# Altium schematic sheet Overview.SchDoc
size A; SheetNumber: 1; SheetTotal: 4
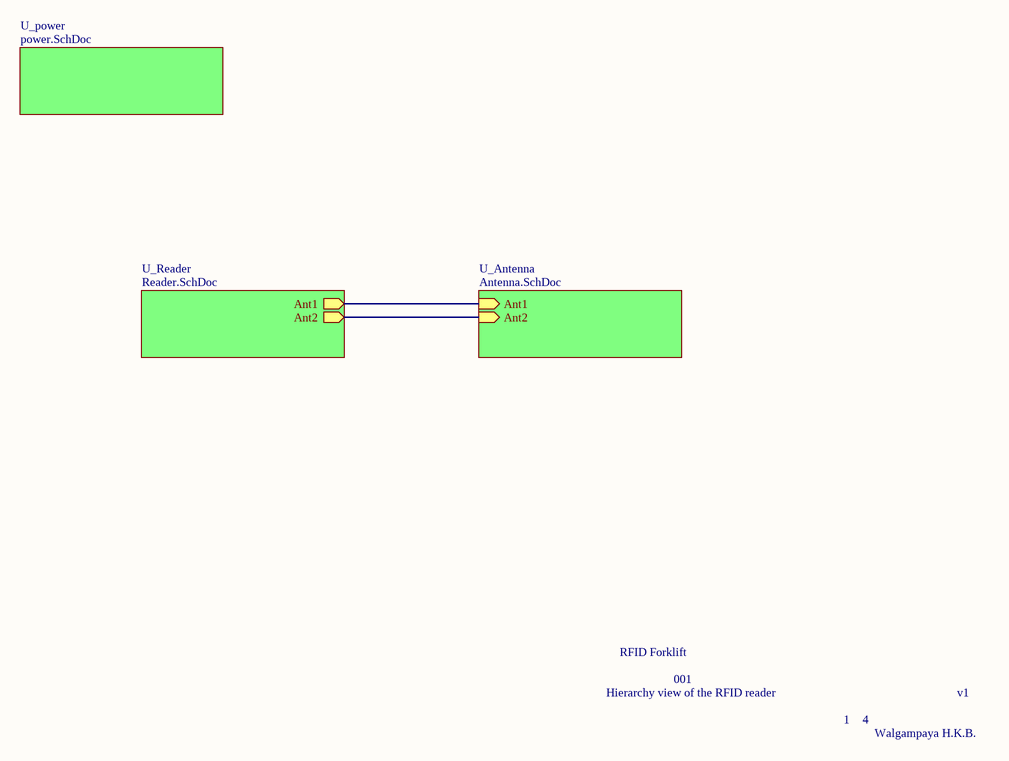
[diagram p0: Overview.SchDoc]

## Sub-sheets
U_Antenna = Antenna.SchDoc: Ant1 (in), Ant2 (in)
U_power = power.SchDoc: no entries
U_Reader = Reader.SchDoc: Ant1 (out), Ant2 (out)

## Nets
(unnamed): sheet U_Antenna/Ant1, sheet U_Reader/Ant1
(unnamed): sheet U_Antenna/Ant2, sheet U_Reader/Ant2

## Notes on the sheet
- RFID Forklift
- Hierarchy view of the RFID reader
- 001
- 1
- 4
- v1
- Walgampaya H.K.B.